# Altium schematic sheet linobit-coilInputs.SchDoc
size A4
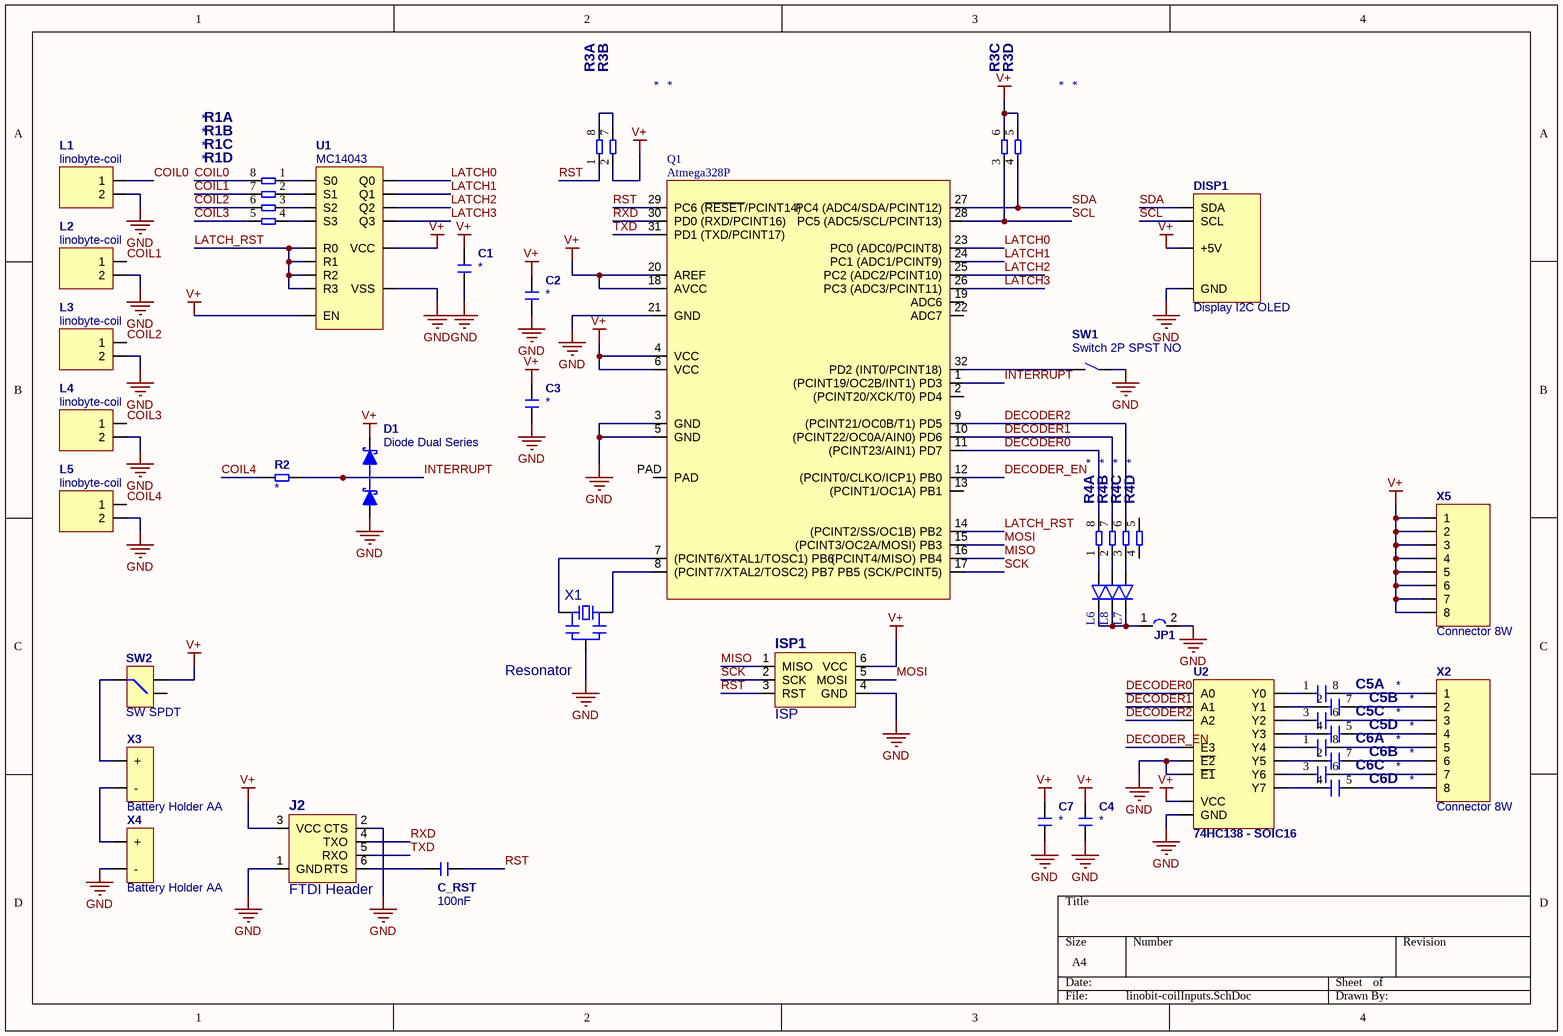
[diagram p0: linobit-coilInputs.SchDoc]

## Parts
C1  *  [C0603_N]
C2  *  [C0603_N]
C3  *  [C0603_N]
C4  *  [C0603_N]
C5  (no value)  [C0612 Array 4 Caps]  (parts A,B,C,D of 4)
C6  (no value)  [C0612 Array 4 Caps]  (parts A,B,C,D of 4)
C7  *  [C0603_N]
C_RST  100nF  [C0603_N]
D1  Diode Dual Series  [SOT23_N]
DISP1  Display I2C OLED  [Display OLED 128x64 0.96in]
ISP1  ISP  [ISP PTH]
J2  FTDI Header  [Header 5W SMD 0.1"]
JP1  Jumper 2W  [Jumper SMD 2W NO]  (value not drawn)
L1  linobyte-coil  [linobyte-coil]
L2  linobyte-coil  [linobyte-coil]
L3  linobyte-coil  [linobyte-coil]
L4  linobyte-coil  [linobyte-coil]
L5  linobyte-coil  [linobyte-coil]
L6  LED  [LED 0603/1608]  (value not drawn)
L7  LED  [LED 0603/1608]  (value not drawn)
L8  LED  [LED 0603/1608]  (value not drawn)
Q1  Atmega328P  [TQFP32]
R1  (no value)  [YC164]  (parts A,B,C,D of 4)
R2  *  [R0603]
R3  (no value)  [YC164]  (parts A,B,C,D of 4)
R4  (no value)  [YC164]  (parts A,B,C,D of 4)
SW1  Switch 2P SPST NO  [TACT FSMSM]
SW2  SW SPDT  [SW SPDT JS102011SAQN]
U1  MC14043  [SOIC16]
U2  74HC138 - SOIC16  [SOIC16]
X1  Resonator  [Resonator]
X2  Connector 8W  [BCS-108-L-S-PE]
X3  Battery Holder AA  [Battery Holder AA]
X4  Battery Holder AA  [Battery Holder AA]
X5  Connector 8W  [BCS-108-L-S-PE]

## Nets
GND: C1.2 C2.2 C3.2 C4.2 C7.2 D1.1(A) DISP1.1(GND) ISP1.4(GND) J2.1(GND) J2.2(CTS) JP1.2 L1.2 L2.2 L3.2 L4.2 L5.2 Q1.3(GND) Q1.5(GND) Q1.21(GND) SW1.2 U1.8(VSS) U2.4(~{E2}) U2.6(~{E1}) U2.8(GND) X1.2 X4.-
V+: C1.1 C2.1 C3.1 C4.1 C7.1 D1.2(K) DISP1.2(+5V) ISP1.6(VCC) J2.3(VCC) Q1.4(VCC) Q1.6(VCC) Q1.18(AVCC) Q1.20(AREF) R3.2 R3.5 R3.6 SW2.1 U1.5(EN) U1.16(VCC) U2.16(VCC) X5.1 X5.2 X5.3 X5.4 X5.5 X5.6 X5.7 X5.8
COIL0: L1.1 R1.8
COIL1: L2.1 R1.7
COIL2: L3.1 R1.6
COIL3: L4.1 R1.5
COIL4: L5.1 R2.1
DECODER0: Q1.11((PCINT23/AIN1)_PD7) R4.8 U2.1(A0)
DECODER1: Q1.10((PCINT22/OC0A/AIN0)_PD6) R4.7 U2.2(A1)
DECODER2: Q1.9((PCINT21/OC0B/T1)_PD5) R4.6 U2.3(A2)
DECODER_EN: Q1.12((PCINT0/CLKO/ICP1)_PB0) U2.5(E3)
INTERRUPT: D1.3(A) Q1.1((PCINT19/OC2B/INT1)_PD3) R2.2
LATCH0: Q1.23(PC0_(ADC0/PCINT8)) U1.2(Q0)
LATCH1: Q1.24(PC1_(ADC1/PCINT9)) U1.9(Q1)
LATCH2: Q1.25(PC2_(ADC2/PCINT10)) U1.10(Q2)
LATCH3: Q1.26(PC3_(ADC3/PCINT11)) U1.1(Q3)
LATCH_RST: Q1.14((PCINT2/SS/OC1B)_PB2) U1.3(R0) U1.7(R1) U1.11(R2) U1.15(R3)
MISO: ISP1.1(MISO) Q1.16((PCINT4/MISO)_PB4)
MOSI: ISP1.5(MOSI) Q1.15((PCINT3/OC2A/MOSI)_PB3)
RST: C_RST.2 ISP1.3(RST) Q1.29(PC6_(~{RESET}/PCINT14)) R3.1
RXD: J2.4(TXO) Q1.30(PD0_(RXD/PCINT16))
SCK: ISP1.2(SCK) Q1.17(PB5_(SCK/PCINT5))
SCL: DISP1.3(SCL) Q1.28(PC5_(ADC5/SCL/PCINT13)) R3.3
SDA: DISP1.4(SDA) Q1.27(PC4_(ADC4/SDA/PCINT12)) R3.4
TXD: J2.5(RXO) Q1.31(PD1_(TXD/PCINT17))
NetC5_1: C5.1 U2.15(Y0)
NetC5_2: C5.2 U2.14(Y1)
NetC5_3: C5.3 U2.13(Y2)
NetC5_4: C5.4 U2.12(Y3)
NetC5_5: C5.5 X2.4
NetC5_6: C5.6 X2.3
NetC5_7: C5.7 X2.2
NetC5_8: C5.8 X2.1
NetC6_1: C6.1 U2.11(Y4)
NetC6_2: C6.2 U2.10(Y5)
NetC6_3: C6.3 U2.9(Y6)
NetC6_4: C6.4 U2.7(Y7)
NetC6_5: C6.5 X2.8
NetC6_6: C6.6 X2.7
NetC6_7: C6.7 X2.6
NetC6_8: C6.8 X2.5
NetC_RST_1: C_RST.1 J2.6(RTS)
NetJP1_1: JP1.1 L6.1(K) L7.1(K) L8.1(K)
NetL6_2: L6.2(A) R4.1
NetL7_2: L7.2(A) R4.3
NetL8_2: L8.2(A) R4.2
NetQ1_7: Q1.7((PCINT6/XTAL1/TOSC1)_PB6) X1.1
NetQ1_8: Q1.8((PCINT7/XTAL2/TOSC2)_PB7) X1.3
NetQ1_32: Q1.32(PD2_(INT0/PCINT18)) SW1.1
NetR1_1: R1.1 U1.4(S0)
NetR1_2: R1.2 U1.6(S1)
NetR1_3: R1.3 U1.12(S2)
NetR1_4: R1.4 U1.14(S3)
NetR3_7: R3.7 R3.8
NetSW2_2: SW2.2 X3.+
NetX3_-: X3.- X4.+

Not connected (* = marked no-connect by the designer): Q1 2((PCINT20/XCK/T0)_PD4) 13((PCINT1/OC1A)_PB1) 19(ADC6) 22(ADC7) PAD; R4 4 5; SW2 3

## Library data of the parts
C1-C4 C7 C_RST = Capacitor: Capacitor MLCC; Manufacturer: Yageo; Manufacturer Part Number: CC0603KRX7R9BB104; Tolerance (%): 10; Category: Capacitor; Package: 0603; Supplier Part Number 1: 1362556; Supplier 1: Farnell; ComponentLink1URL: http://www.yageo.com; ComponentLink1Description: Manufacturer Website; Voltage Rating (Volts): *; Supplier 2: Digi-Key; Supplier Part Number 2: 311-1344-1-ND
  C1-C4 C7: Value: *
  C_RST: Value: 100nF
C5 C6 = Capacitor Array - 4P: Value: *
R1 R3 R4 = Resistor Array - 4P: Value: *
R2 = Resistor: Published: 17-Dec-2003; LatestRevisionDate: 19-Mar-2004; LatestRevisionNote: Silkscreen size reduced.; PackageDocument: Mar-2003; PackageReference: 3-0603; Publisher: Altium Limited; Code_IPC: 1608 [0603]; ComponentLink1Description: Manufacturer Link; ComponentLink1URL: http://www.panasonic.com/industrial/components/resistive_products.htm; ComponentLink2Description: Datasheet; ComponentLink2URL: http://www.panasonic.com/industrial/components/pdf/AOA0000CE2.pdf; Value: *
X1 = Resonator: Value: *